# Altium project m.PrjPCB
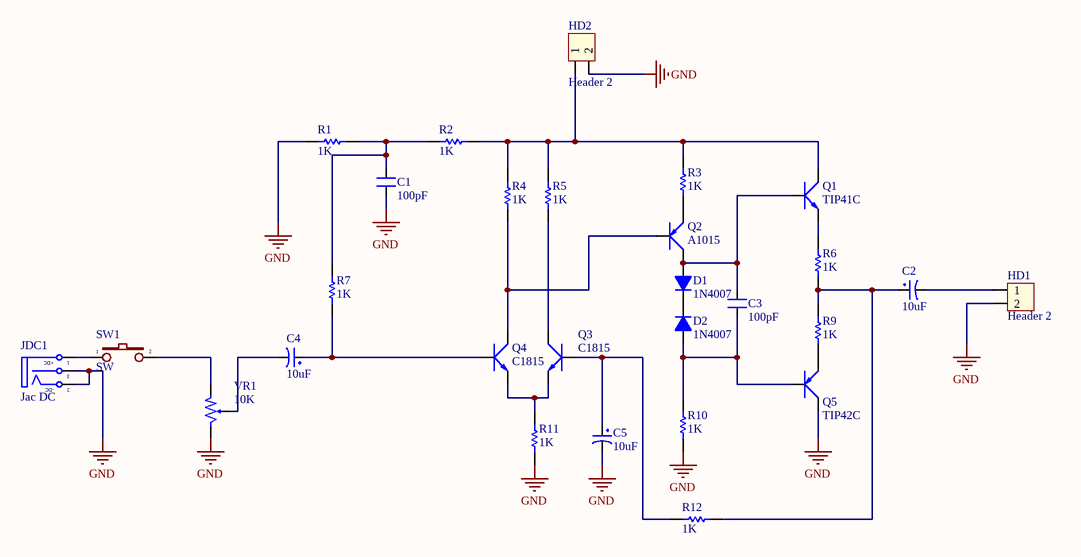
[diagram p0: nguyenly.SchDoc]
1 sheet, 28 parts. Net scope: global (net labels, ports and power ports of the same name join across sheets).
Board files: hh.PcbDoc, hoanchinh.PcbDoc, machkhuechdai.PcbDoc

## Sheet nguyenly.SchDoc
size A4

### Parts
C1  100pF  [CN1]
C2  10uF  [CP1/2]
C3  100pF  [CN1]
C4  10uF  [CP1/2]
C5  10uF  [CP1/2]
D1  1N4007  [D1A]
D2  1N4007  [D1A]
HD1  Header 2  [HED2]
HD2  Header 2  [HED2]
JDC1  Jac DC  [DC-IN]
Q1  TIP41C  [QTO-220]
Q2  A1015  [QTO-92]
Q3  C1815  [QTO-92]
Q4  C1815  [QTO-92]
Q5  TIP42C  [QTO-220]
R1  value 1K  [R1/4W]  (hidden comment: Res1)
R2  value 1K  [R1/4W]  (hidden comment: Res1)
R3  value 1K  [R1/4W]  (hidden comment: Res1)
R4  value 1K  [R1/4W]  (hidden comment: Res1)
R5  value 1K  [R1/4W]  (hidden comment: Res1)
R6  value 1K  [R1/4W]  (hidden comment: Res1)
R7  value 1K  [R1/4W]  (hidden comment: Res1)
R9  value 1K  [R1/4W]  (hidden comment: Res1)
R10  value 1K  [R1/4W]  (hidden comment: Res1)
R11  value 1K  [R1/4W]  (hidden comment: Res1)
R12  value 1K  [R1/4W]  (hidden comment: Res1)
SW1  SW  [SW2]
VR1  10K  [VR]

### Nets
GND: C1.1 C5.2 HD1.2 HD2.2 JDC1.2(TN) JDC1.3(S) Q5.2(C) R1.2 R10.2 R11.2 VR1.3
NetC1_2: C1.2 R1.1 R2.2 R7.1
NetC2_1: C2.1 R6.2 R9.1 R12.2
NetC2_2: C2.2 HD1.1
NetC3_1: C3.1 D2.1(A) Q5.1(B) R10.1
NetC3_2: C3.2 D1.1(A) Q1.1(B) Q2.2(C)
NetC4_1: C4.1 Q4.3(B) R7.2
NetC4_2: C4.2 VR1.2
NetC5_1: C5.1 Q3.3(B) R12.1
NetD1_2: D1.2(K) D2.2(K)
NetHD2_1: HD2.1 Q1.2(C) R2.1 R3.1 R4.1 R5.1
NetJDC1_1: JDC1.1(T) SW1.1
NetQ1_3: Q1.3(E) R6.1
NetQ2_1: Q2.1(E) R3.2
NetQ2_3: Q2.3(B) Q4.2(C) R4.2
NetQ3_1: Q3.1(E) Q4.1(E) R11.1
NetQ3_2: Q3.2(C) R5.2
NetQ5_3: Q5.3(E) R9.2
NetSW1_2: SW1.2 VR1.1

### Notes on the sheet
- (in symbol DCIN) +DC; -DC

### Library data of the parts
C1 C3 = CN1: Cap np  1pF - 472pF; Value: 100pF
C2 C4 C5 = CP1: Cap P  0,1uF < 22uF , 16 - 50V; Value: 10uF/50V; Description 1: 10 => 220uF/6,3V/10V - 10uF => 100uF/16V; Description 2: 0,1uF => 33uF/50V - 10uF => 22uF/63V; Description 3: 0,47uF => 10uF/100V
D1 D2 = D1A: Diode 1A; Value: 1N4007
HD1 HD2 = Hed2: Header 2 (Green); Value: Header 2
JDC1 = DCIN: Jac DC input; Value: Jac DC
Q1 = TIP41C: NPN 2W, BCE; Value: TIP41C
Q2 = A1015: PNP 600mW, ECB; Value: A1015
Q3 Q4 = C1815: NPN 600mW, ECB; Value: C1815
Q5 = TIP42C: PNP 2W, BCE; Value: TIP42C
R1-R7 R9-R12 = Res1_1: Resistor; Manufacturer: Generic Components; Class: Passive; Published: 08/06/2000; Publisher: Altium Hobart Technology Centre; SubClass: Resistor
SW1 = SW2: Switch button 2 pin; Value: SW chip 2 pin
VR1 = VR1: Var Resistor; Value: VR 10K